# Altium schematic sheet Motors.SchDoc
size Tabloid; Organization: Altium Limited; Address1: L3, 12a Rodborough Rd; Address2: Frenchs Forest; Address3: NSW; Address4: Australia 2086
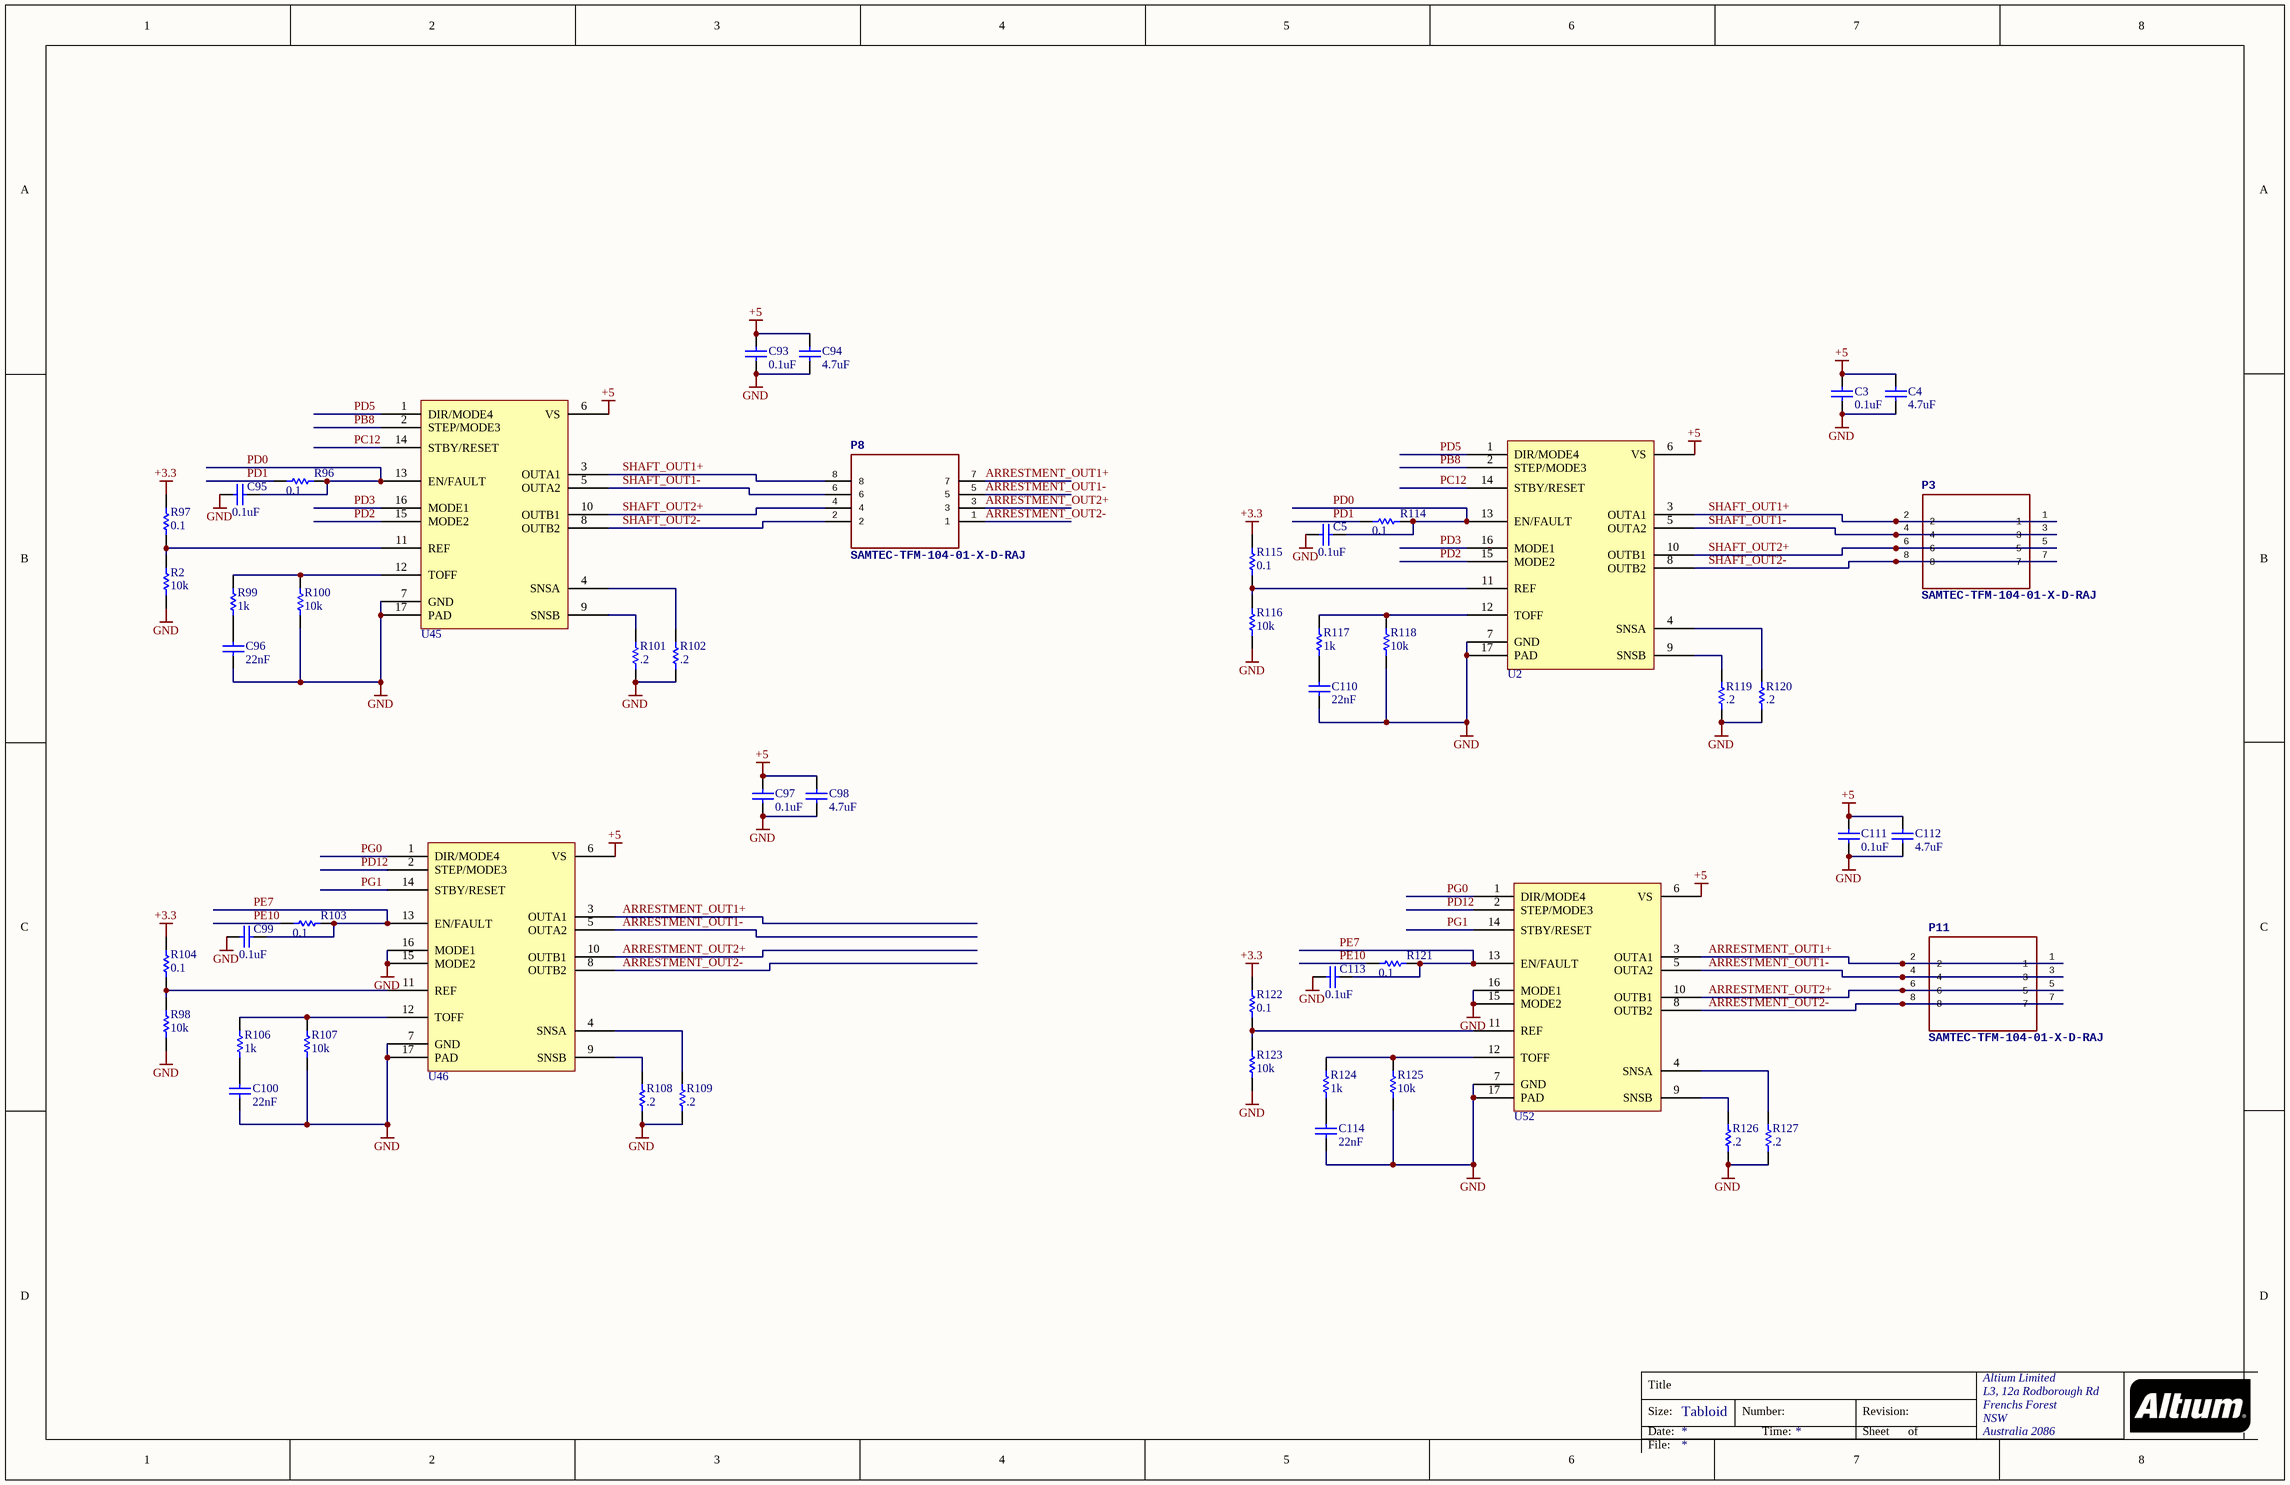
[diagram p0: Motors.SchDoc]

## Parts
C3  0.1uF  [CAPC1608X94X35LL15T15]
C4  4.7uF  [CAPC0603(1608)55_M]
C5  0.1uF  [CAPC1608X94X35LL15T15]
C93  0.1uF  [CAPC1608X94X35LL15T15]
C94  4.7uF  [CAPC0603(1608)55_M]
C95  0.1uF  [CAPC1608X94X35LL15T15]
C96  22nF  [CAPC1608X94X35LL15T15]
C97  0.1uF  [CAPC1608X94X35LL15T15]
C98  4.7uF  [CAPC0603(1608)55_M]
C99  0.1uF  [CAPC1608X94X35LL15T15]
C100  22nF  [CAPC1608X94X35LL15T15]
C110  22nF  [CAPC1608X94X35LL15T15]
C111  0.1uF  [CAPC1608X94X35LL15T15]
C112  4.7uF  [CAPC0603(1608)55_M]
C113  0.1uF  [CAPC1608X94X35LL15T15]
C114  22nF  [CAPC1608X94X35LL15T15]
P3  SAMTEC-TFM-104-01-X-D-RAJ  [SAMTEC-TFM-104-01-X-D-RA]
P8  SAMTEC-TFM-104-01-X-D-RAJ  [SAMTEC-TFM-104-01-X-D-RA]
P11  SAMTEC-TFM-104-01-X-D-RAJ  [SAMTEC-TFM-104-01-X-D-RA]
R2  10k  [RESC0603(1608)_N]
R96  0.1  [RESC0603(1608)_N]
R97  0.1  [RESC0603(1608)_N]
R98  10k  [RESC0603(1608)_N]
R99  1k  [RESC0603(1608)_N]
R100  10k  [RESC0603(1608)_N]
R101  .2  [RESC0603(1608)_N]
R102  .2  [RESC0603(1608)_N]
R103  0.1  [RESC0603(1608)_N]
R104  0.1  [RESC0603(1608)_N]
R106  1k  [RESC0603(1608)_N]
R107  10k  [RESC0603(1608)_N]
R108  .2  [RESC0603(1608)_N]
R109  .2  [RESC0603(1608)_N]
R114  0.1  [RESC0603(1608)_N]
R115  0.1  [RESC0603(1608)_N]
R116  10k  [RESC0603(1608)_N]
R117  1k  [RESC0603(1608)_N]
R118  10k  [RESC0603(1608)_N]
R119  .2  [RESC0603(1608)_N]
R120  .2  [RESC0603(1608)_N]
R121  0.1  [RESC0603(1608)_N]
R122  0.1  [RESC0603(1608)_N]
R123  10k  [RESC0603(1608)_N]
R124  1k  [RESC0603(1608)_N]
R125  10k  [RESC0603(1608)_N]
R126  .2  [RESC0603(1608)_N]
R127  .2  [RESC0603(1608)_N]
U2  STSPIN220  [STSPIN220-QFN127P600-8N]  (value not drawn)
U45  STSPIN220  [STSPIN220-QFN127P600-8N]  (value not drawn)
U46  STSPIN220  [STSPIN220-QFN127P600-8N]  (value not drawn)
U52  STSPIN220  [STSPIN220-QFN127P600-8N]  (value not drawn)

## Nets
+3.3: R97.2 R104.2 R115.2 R122.2
+5: C3.1 C4.2 C93.1 C94.2 C97.1 C98.2 C111.1 C112.2 U2.6(VS) U45.6(VS) U46.6(VS) U52.6(VS)
GND: C3.2 C4.1 C5.1 C93.2 C94.1 C95.1 C96.2 C97.2 C98.1 C99.1 C100.2 C110.2 C111.2 C112.1 C113.1 C114.2 R2.1 R98.1 R100.1 R101.1 R102.1 R107.1 R108.1 R109.1 R116.1 R118.1 R119.1 R120.1 R123.1 R125.1 R126.1 R127.1 U2.7(GND) U2.17(PAD) U45.7(GND) U45.17(PAD) U46.7(GND) U46.15(MODE2) U46.16(MODE1) U46.17(PAD) U52.7(GND) U52.15(MODE2) U52.16(MODE1) U52.17(PAD)
ARRESTMENT_OUT1+: P8.7 P11.1 P11.2 U46.3(OUTA1) U52.3(OUTA1)
ARRESTMENT_OUT1-: P8.5 P11.3 P11.4 U46.5(OUTA2) U52.5(OUTA2)
ARRESTMENT_OUT2+: P8.3 P11.5 P11.6 U46.10(OUTB1) U52.10(OUTB1)
ARRESTMENT_OUT2-: P8.1 P11.7 P11.8 U46.8(OUTB2) U52.8(OUTB2)
PB8: U2.2(STEP/MODE3) U45.2(STEP/MODE3)
PC12: U2.14(STBY/RESET) U45.14(STBY/RESET)
PD0: C5.2 C95.2 R96.1 R114.1 U2.13(EN/FAULT) U45.13(EN/FAULT)
PD1: R96.2 R114.2
PD2: U2.15(MODE2) U45.15(MODE2)
PD3: U2.16(MODE1) U45.16(MODE1)
PD5: U2.1(DIR/MODE4) U45.1(DIR/MODE4)
PD12: U46.2(STEP/MODE3) U52.2(STEP/MODE3)
PE7: C99.2 C113.2 R103.1 R121.1 U46.13(EN/FAULT) U52.13(EN/FAULT)
PE10: R103.2 R121.2
PG0: U46.1(DIR/MODE4) U52.1(DIR/MODE4)
PG1: U46.14(STBY/RESET) U52.14(STBY/RESET)
SHAFT_OUT1+: P3.1 P3.2 P8.8 U2.3(OUTA1) U45.3(OUTA1)
SHAFT_OUT1-: P3.3 P3.4 P8.6 U2.5(OUTA2) U45.5(OUTA2)
SHAFT_OUT2+: P3.5 P3.6 P8.4 U2.10(OUTB1) U45.10(OUTB1)
SHAFT_OUT2-: P3.7 P3.8 P8.2 U2.8(OUTB2) U45.8(OUTB2)
NetC96_1: C96.1 R99.1
NetC100_1: C100.1 R106.1
NetC110_1: C110.1 R117.1
NetC114_1: C114.1 R124.1
NetR2_2: R2.2 R97.1 U45.11(REF)
NetR98_2: R98.2 R104.1 U46.11(REF)
NetR99_2: R99.2 R100.2 U45.12(TOFF)
NetR101_2: R101.2 U45.9(SNSB)
NetR102_2: R102.2 U45.4(SNSA)
NetR106_2: R106.2 R107.2 U46.12(TOFF)
NetR108_2: R108.2 U46.9(SNSB)
NetR109_2: R109.2 U46.4(SNSA)
NetR115_1: R115.1 R116.2 U2.11(REF)
NetR117_2: R117.2 R118.2 U2.12(TOFF)
NetR119_2: R119.2 U2.9(SNSB)
NetR120_2: R120.2 U2.4(SNSA)
NetR122_1: R122.1 R123.2 U52.11(REF)
NetR124_2: R124.2 R125.2 U52.12(TOFF)
NetR126_2: R126.2 U52.9(SNSB)
NetR127_2: R127.2 U52.4(SNSA)

## Notes on the sheet
- Title
- Size:
- Date:
- Tabloid
- Number:
- Time:
- Revision:
- Sheet
- of
- File:

## Library data of the parts
C3 C5 C93 C95-C97 C99 C100 C110 C111 C113 C114 = CMP-1661-00001-2: CAP .1UF 16V CERAMIC X7R 0603; Manufacturer: Yageo; Manufacturer Part Number: CC0603KRX7R7BB105; Capacitance: 1uF; Tolerance: 10%; Dissipation Factor: 5%; ComponentLink1Description: Datasheet; ComponentLink1URL: http://datasheets.avx.com/X7RDielectric.pdf; Supplier 1: Digi-Key; Supplier Part Number 1: 311-1446-6-ND; Stock 1: 5506121; Pricing 1: 1=0.21, 10=0.143, 100=0.0727, 500=0.04974, 1000=0.044 (USD); Mount: Surface Mount; Case/Package: 0603; Number of Pins: 2; Case Code (Metric): 1608; Case Code (Imperial): 0603; Min Operating Temperature: -55°C; Max Operating Temperature: 125°C; Voltage Rating: 16V; Package Quantity: 1; Packaging: Tape and Reel; Voltage Rating (DC): 16V; Dielectric: X7R; Termination: SMD/SMT; Voltage: 16V; Composition: Ceramic; Length: 1.6mm; Height: 0.8mm; Width: 0.031inch; Thickness: 0.035inch; Depth: 0.8mm; Radiation Hardening: No; REACH SVHC: Unknown; Lead Free: Lead Free; Halogen Free: Halogen Free; ComponentLink2URL: http://www.yageo.com/documents/recent/UPY-GPHC_X7R_6.3V-to-50V_18.pdf; ComponentLink2Description: http://www.yageo.com/documents/recent/UPY-GPHC_X7R_6.3V-to-50V_18.pdf; ComponentLink3URL: http://www.yageo.com/documents/recent/UPY-GPHC_X7R_6.3V-to-50V_8.pdf; ComponentLink3Description: http://www.yageo.com/documents/recent/UPY-GPHC_X7R_6.3V-to-50V_8.pdf; ComponentLink4URL: http://www.farnell.com/datasheets/1734573.pdf; ComponentLink4Description: http://www.farnell.com/datasheets/1734573.pdf; ComponentLink5URL: http://www.farnell.com/datasheets/1489800.pdf; ComponentLink5Description: http://www.farnell.com/datasheets/1489800.pdf
C4 C94 C98 C112 = CMP-1035-02779-1: CAP 4.7uF 6.3V ±10% 0603 (1608 Metric) Thickness 0.55mm SMD; Manufacturer: KEMET; Manufacturer Part Number: C0603C475K9PACTU; Case-EIA: 0603; Tolerance: Â±10%; Case-Metric: 1608; Dielectric Material: Ceramic; Dielectric: X5R; Dissipation Factor: 5%; Technology: SMT; Value: 4.7uF; Max Thickness: 0.55 mm; Rated Voltage: 6.3 V; Supplier 1: Digi-Key; Supplier Part Number 1: 399-3482-6-ND; Stock 1: 1765509; Pricing 1: 1=0.21, 10=0.15, 100=0.0706, 500=0.04952, 1000=0.041 (USD); Mount: PCB,Surface Mount; Case/Package: 0603; Number of Pins: 2; Case Code (Metric): 1608; Case Code (Imperial): 0603; Contact Plating: Matte,Tin; Min Operating Temperature: -55°C; Max Operating Temperature: 85°C; Package Quantity: 1; Capacitance: 4.7uF; Voltage Rating: 6.3V; Packaging: Tape and Reel; Termination: SMD/SMT; Voltage Rating (DC): 6.3V; Voltage: 6.3V; Length: 1.6mm; Height: 0.8mm; Width: 0.031inch; Thickness: 0.035inch; Depth: 0.8mm; Lead Pitch: 0.7mm; Radiation Hardening: No; Lead Free: Lead Free; REACH SVHC: No SVHC; ComponentLink1URL: https://api.kemet.com/component-edge/download/datasheet/C0603C475K9PACTU.pdf; ComponentLink1Description: https://api.kemet.com/component-edge/download/datasheet/C0603C475K9PACTU.pdf; ComponentLink2URL: http://www.farnell.com/datasheets/1732700.pdf; ComponentLink2Description: http://www.farnell.com/datasheets/1732700.pdf; ComponentLink3URL: http://www.farnell.com/datasheets/1789732.pdf; ComponentLink3Description: http://www.farnell.com/datasheets/1789732.pdf; ComponentLink4URL: http://www.farnell.com/datasheets/40889.pdf; ComponentLink4Description: http://www.farnell.com/datasheets/40889.pdf
R2 R96-R104 R106-R109 R114-R127 = CMP-1012-00511-1: 0R12 0.1W 1% 0603 (1608 Metric)  SMD; Manufacturer: Vishay; Manufacturer Part Number: CRCW060310K0FKEA; Value: 1020.00 Ohm; Case-EIA: 0603; Case-Metric: 1608; Resistance: 10kR; Power Rating: 100mW; Voltage Rating: 75V; Temperature Coefficient: 100ppm/°C; Technology: SMT; Power: 0.1 W; Tolerance: 1 %; Supplier 1: Digi-Key; Supplier Part Number 1: 311-0.0GRDKR-ND; Stock 1: 49641653; Pricing 1: 1=0.1, 10=0.021, 25=0.0152, 50=0.0114, 100=0.0084, 250=0.00644, 500=0.00514, 1000=0.00379 (USD); Case/Package: 0603; Number of Pins: 2; Weight: 7.1E-05oz; Case Code (Metric): 1608; Case Code (Imperial): 0603; Contact Plating: Lead,Tin; Min Operating Temperature: -55°C; Max Operating Temperature: 155°C; Packaging: Tape and Reel; Package Quantity: 10; Composition: Thick Film; Military Standard: Not; Termination: SMD/SMT; Voltage Rating (DC): 75V; Number of Terminations: 2; Max Power Dissipation: 100mW; Features: Automotive AEC-Q200; Length: 1.55mm; Height: 0.45mm; Width: 0.033inch; Depth: 0.85mm; Radiation Hardening: No; REACH SVHC: Unknown; Lead Free: Lead Free; ComponentLink1URL: http://www.vishay.com/docs/20008/dcrcw.pdf; ComponentLink1Description: http://www.vishay.com/docs/20008/dcrcw.pdf; ComponentLink2URL: https://www.verical.com/server-webapp/html/getDatasheet?partID=86831; ComponentLink2Description: https://www.verical.com/server-webapp/html/getDatasheet?partID=86831; ComponentLink3URL: http://www.farnell.com/datasheets/2310790.pdf; ComponentLink3Description: http://www.farnell.com/datasheets/2310790.pdf; ComponentLink4URL: http://www.vishay.com/docs/20035/dcrcwe3.pdf; ComponentLink4Description: http://www.vishay.com/docs/20035/dcrcwe3.pdf; ComponentLink5URL: http://www.farnell.com/datasheets/2111203.pdf; ComponentLink5Description: http://www.farnell.com/datasheets/2111203.pdf; ComponentLink6URL: http://uk.rs-online.com/webdocs/0d98/0900766b80d98afc.pdf; ComponentLink6Description: http://uk.rs-online.com/webdocs/0d98/0900766b80d98afc.pdf